# EAGLE design Master Volume 1.55 x 1.95 (EAGLE 6.5.0)
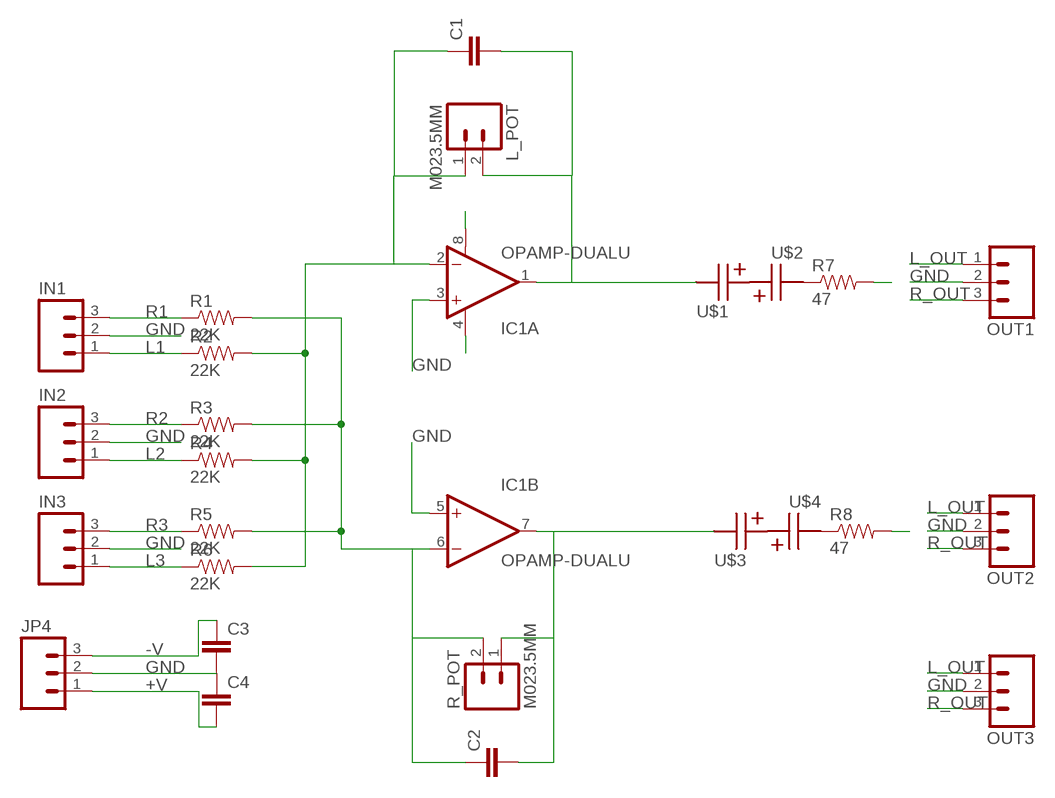
[diagram p0: schematic, sheet 1]

## Parts
C1  CAP0805  [0805]
C2  CAP0805  [0805]
C3  CAP1206  [1206]
C4  CAP1206  [1206]
IC1  OPAMP-DUALU  [SO08]
IN1  M03SCREW  [SCREWTERMINAL-3.5MM-3]
IN2  M03SCREW  [SCREWTERMINAL-3.5MM-3]
IN3  M03SCREW  [SCREWTERMINAL-3.5MM-3]
JP4  M03SCREW  [SCREWTERMINAL-3.5MM-3]
L_POT  M023.5MM  [SCREWTERMINAL-3.5MM-2]
OUT1  M03SCREW  [SCREWTERMINAL-3.5MM-3]
OUT2  M03SCREW  [SCREWTERMINAL-3.5MM-3]
OUT3  M03SCREW  [SCREWTERMINAL-3.5MM-3]
R1  22K  RESISTORPTH-1/4W  [AXIAL-0.4]
R2  22K  RESISTORPTH-1/4W  [AXIAL-0.4]
R3  22K  RESISTORPTH-1/4W  [AXIAL-0.4]
R4  22K  RESISTORPTH-1/4W  [AXIAL-0.4]
R5  22K  RESISTORPTH-1/4W  [AXIAL-0.4]
R6  22K  RESISTORPTH-1/4W  [AXIAL-0.4]
R7  47  RESISTORPTH-1/4W  [AXIAL-0.4]
R8  47  RESISTORPTH-1/4W  [AXIAL-0.4]
R_POT  M023.5MM  [SCREWTERMINAL-3.5MM-2]
U$1  5MM-12.5MM-POLAR2MMX5MM  [2MMLEAD_5MMDIAMETER]
U$2  5MM-12.5MM-POLAR2MMX5MM  [2MMLEAD_5MMDIAMETER]
U$3  5MM-12.5MM-POLAR2MMX5MM  [2MMLEAD_5MMDIAMETER]
U$4  5MM-12.5MM-POLAR2MMX5MM  [2MMLEAD_5MMDIAMETER]

## Nets
+V: C4.2 IC1.8(A:V+) JP4.1
-V: C3.1 IC1.4(A:V-) JP4.3
GND: C3.2 C4.1 IC1.3(A:+IN) IC1.5(B:+IN) IN1.2 IN2.2 IN3.2 JP4.2 OUT1.2 OUT2.2 OUT3.2
L1: IN1.1 R2.P$1
L2: IN2.1 R4.P$1
L3: IN3.1 R6.P$1
L_OUT: OUT1.1 OUT2.1 OUT3.1 R7.P$2
N$1: C1.1 IC1.2(A:-IN) L_POT.1 R2.P$2 R4.P$2 R6.P$2
N$2: C2.1 IC1.6(B:-IN) R1.P$2 R3.P$2 R5.P$2 R_POT.2
N$3: C1.2 IC1.1(A:OUT) L_POT.2 U$1.+(-)
N$4: C2.2 IC1.7(B:OUT) R_POT.1 U$3.+(-)
N$5: U$1.-(+) U$2.-(+)
N$6: U$3.-(+) U$4.-(+)
N$7: R7.P$1 U$2.+(-)
N$8: R8.P$1 U$4.+(-)
R1: IN1.3 R1.P$1
R2: IN2.3 R3.P$1
R3: IN3.3 R5.P$1
R_OUT: OUT1.3 OUT2.3 OUT3.3 R8.P$2

## Library data of the parts
C1-C4 = SparkFun-Capacitors:CAP: Capacitor Standard 0603 ceramic capacitor, and 0.1" leaded capacitor.
IC1 = SparkFun-AnalogIC:OPAMP-DUAL: Generic op-amp footprint
IN1-IN3 JP4 OUT1-OUT3 = SparkFun-Connectors:M03: Header 3 Standard 3-pin 0.1" header. Use with straight break away headers (SKU : PRT-00116), right angle break away headers (PRT-00553), swiss pins (PRT-00743), machine pins (PRT-00117), and female headers (PRT-00115). Molex polarized connector foot print use with SKU : PRT-08232 with associated crimp pins and housings.
L_POT R_POT = SparkFun-Connectors:M02: Standard 2-pin 0.1" header. Use with - straight break away headers ( PRT-00116) - right angle break away headers (PRT-00553) - swiss pins (PRT-00743) - machine pins (PRT-00117) - female headers (PRT-00115) Molex polarized connector foot print use with: PRT-08233 with associated crimp pins and housings. 2.54_SCREWTERM for use with PRT-10571. 3.5mm Screw Terminal footprints for PRT-08084 5mm Screw Terminal footprints for use with PRT-08433
R1-R8 = SparkFun-Resistors:RESISTOR: Resistor Basic schematic elements and footprints for 0603, 1206, and PTH resistors.
U$1-U$4 = AMP Library:5MM-12.5MM-POLAR

## Board
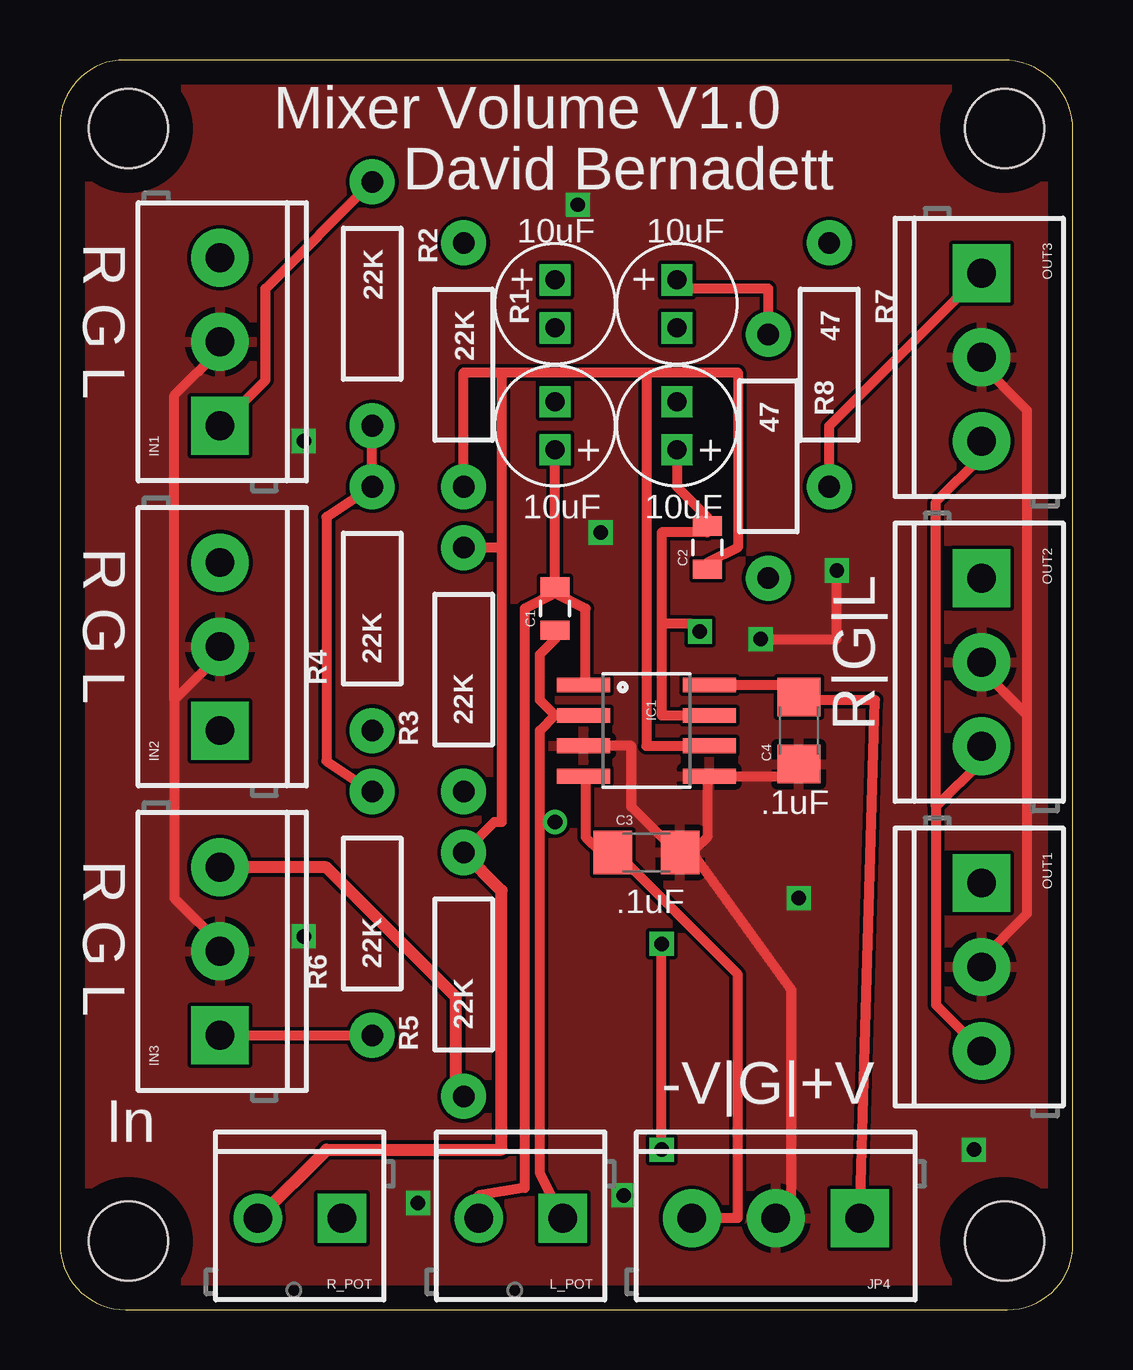
[diagram p1: board, top side]
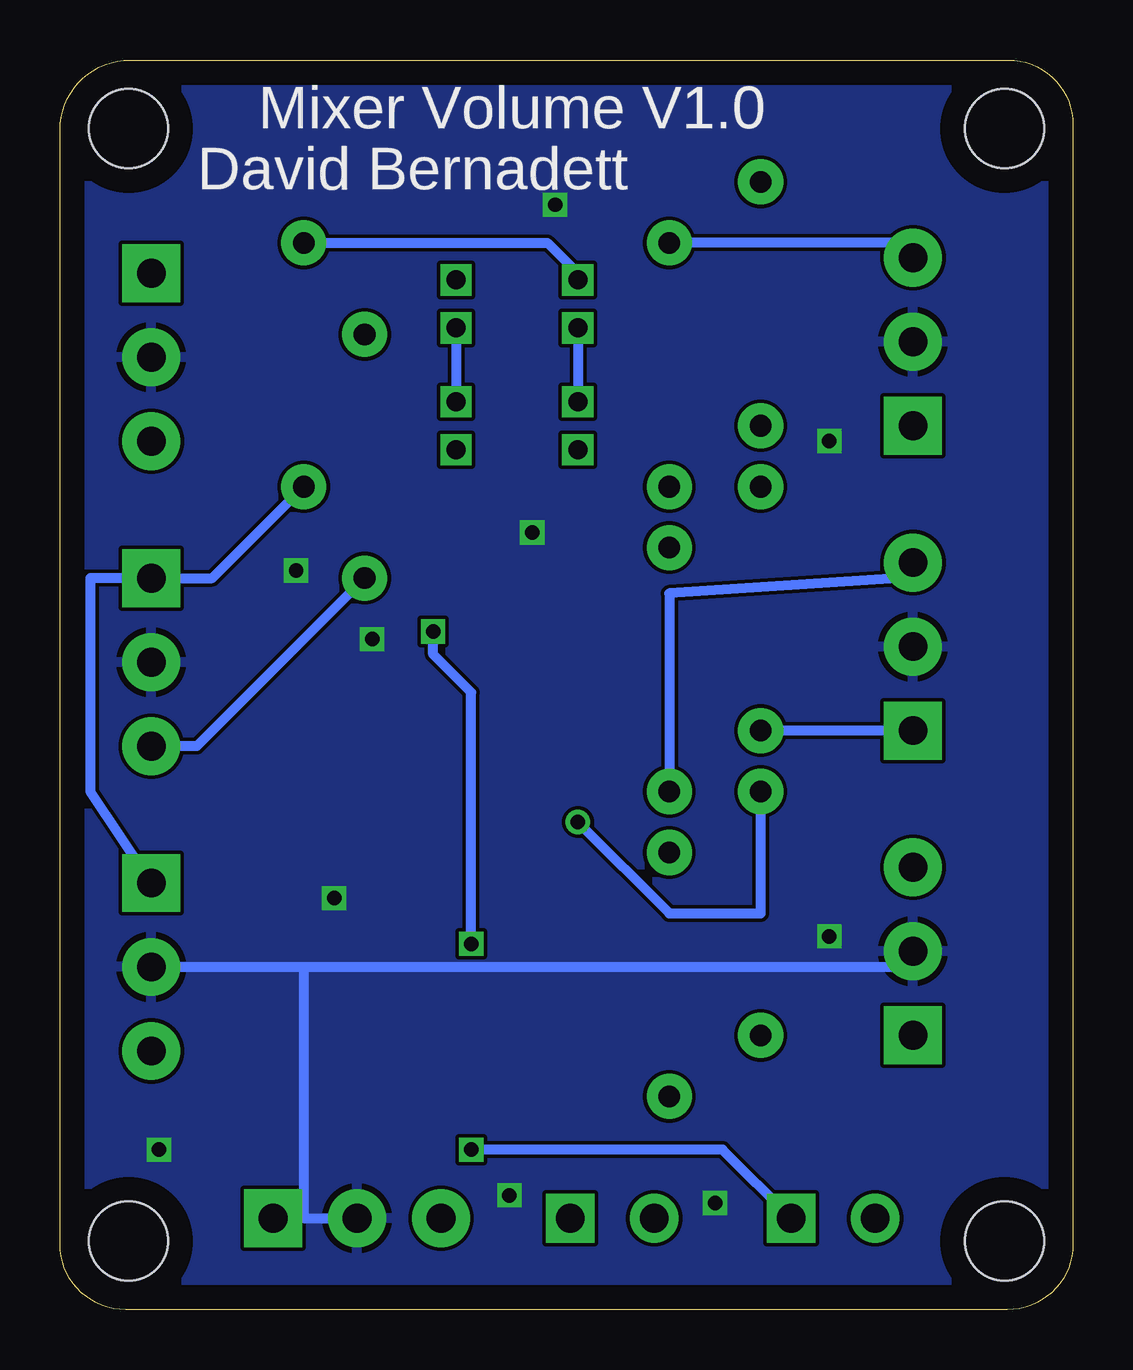
[diagram p2: board, bottom side, seen from below]

Size 42.23 x 52.07 mm. Coordinates in mm from the lower left corner, seen from the top.
Outline: 2.73,0 39.5,0 arc90 42.23,2.73 42.23,49.14 arc90 39.3,52.07 2.69,52.07 arc90 0,49.38 0,2.73 arc90 2.73,0
Copper layers (1*16): Top 0.035mm / dielectric 1.5mm / Bottom 0.035mm
Design rules "default *": minimum track width 10mil, minimum drill 24mil, track to track 6mil, track to pad 8mil, pad to pad 8mil, via to via 8mil, smd to smd 8mil, copper to edge 40mil, drill to drill 8mil, minimum pad ring 10mil, minimum via ring 8mil, stop-mask expansion 4mil, vias tented up to drill 0mil, thermal gap 10mil

### Footprints (pad centres in the part's own frame; a part is rotated, then mirrored left to right if it is on the bottom)
0805 = smd 0.8 x 1.2: 1 -0.9,0; 2 0.9,0
1206 = smd 1.6 x 1.8: 1 -1.4,0; 2 1.4,0
SO08 = smd 0.61 x 2.21: 1 -1.905,-2.616; 2 -0.635,-2.616; 3 0.635,-2.616; 4 1.905,-2.616; 5 1.905,2.616; 6 0.635,2.616; 7 -0.635,2.616; 8 -1.905,2.616
SCREWTERMINAL-3.5MM-3 = drill 1.2 pad 2.413 square: 1 0,0 | drill 1.2 pad 2.413: 2 3.5,0; 3 7,0
SCREWTERMINAL-3.5MM-2 = drill 1.2 pad 2.032 square: 1 0,0 | drill 1.2 pad 2.032: 2 3.5,0
AXIAL-0.4 = drill 0.9 pad 1.88: P$1 -5.08,0; P$2 5.08,0
2MMLEAD_5MMDIAMETER = drill 0.8 square: + 1,0; - -1,0
STAND-OFF = hole 3.302: 0,0

### Placement (x,y rotation side)
C1  20.64,29.21 90 top
C2  26.99,31.75 90 top
C3  24.45,19.05 0 top
C4  30.8,24.13 90 top
IC1  24.45,24.13 270 top
IN1  6.67,36.83 90 top
IN2  6.67,24.13 90 top
IN3  6.67,11.43 90 top
JP4  33.34,3.81 180 top
L_POT  20.95,3.81 180 top
OUT1  38.42,17.78 270 top
OUT2  38.42,30.48 270 top
OUT3  38.42,43.18 270 top
R1  16.83,39.37 270 top
R2  13.02,41.91 270 top
R3  16.83,26.67 90 top
R4  13.02,29.21 90 top
R5  16.83,13.97 90 top
R6  13.02,16.51 90 top
R7  32.07,39.37 270 top
R8  29.53,35.56 270 top
R_POT  11.75,3.81 180 top
U$1  20.64,36.83 270 top
U$2  20.64,41.91 90 top
U$3  25.72,36.83 270 top
U$4  25.72,41.91 90 top
U$5  [STAND-OFF]  2.86,2.86 0 top
U$6  [STAND-OFF]  39.37,2.86 0 top
U$7  [STAND-OFF]  2.86,49.21 0 top
U$8  [STAND-OFF]  39.37,49.21 0 top

### Tracks (layer width: path | path; a pad name or v marks a point on that pad's centre or on a via)
+V
  Top 0.406: IC1.8 30.8,26.04 C4.2 30.8,25.4 33.97,25.4 JP4.1
-V
  Top 0.406: IC1.4 21.91,22.23 21.91,19.68 22.54,19.05 C3.1 23.18,19.05 28.26,13.97 28.26,3.81 JP4.3
GND  (via drill 0.6)
  Top 0.406: 4.76,25.4 4.76,17.14 6.67,15.24 IN3.2 | 4.76,25.4 6.67,27.3 IN2.2 | 4.76,25.4 4.76,38.1 6.67,40.01 IN1.2 | 26.35,19.05 26.99,19.68 26.99,22.23 IC1.5 30.8,22.23 C4.1 | IC1.3 23.81,23.5 23.81,20.95 25.72,19.05 C3.2 26.35,19.05 | 40.32,24.77 38.42,26.67 OUT2.2 | 40.32,24.77 40.32,16.51 38.42,14.61 OUT1.2 | 40.32,24.77 40.32,37.47 38.42,39.37 OUT3.2 | 26.35,19.05 30.48,13.34 30.48,3.81 JP4.2 | v29.21,27.94 32.38,27.94 v32.38,30.8
  Bottom 0.406: 32.07,14.29 32.07,3.81 JP4.2 | 32.07,14.29 OUT1.2 | 32.07,14.29 7.3,14.29 6.67,14.61 IN3.2
  other vias: 30.8,17.14 22.54,32.38 21.59,46.04 38.1,6.67 10.16,36.2 10.16,15.56 14.92,4.45 23.49,4.76
  pour Bottom: 0,52.07 42.23,52.07 42.23,0 0,0
  pour Top: 0,52.07 0,0 42.23,0 42.23,52.07
L1
  Top 0.406: R2.P$1 8.57,42.55 8.57,38.73 IN1.1
L2
  Bottom 0.406: IN2.1 R4.P$1
L3
  Top 0.406: IN3.1 R6.P$1
L_OUT
  Top 0.406: OUT3.1 32.07,36.83 R7.P$2
  Bottom 0.406: R7.P$2 35.88,30.48 OUT2.1 40.96,30.48 40.96,21.59 OUT1.1
N$1  (via drill 0.61)
  Top 0.406: R6.P$2 11.11,22.86 11.11,33.02 R4.P$2 R2.P$2 | 20.64,24.77 20,25.4 20,27.3 20.64,27.94 C1.1 | IC1.2 20.64,24.77 | 20.64,24.77 20,24.13 20,20.32 | 20,20.32 20,5.71 L_POT.1 | 20,20.32 v20.64,20.32
  Bottom 0.406: R6.P$2 13.02,16.51 16.83,16.51 v20.64,20.32
N$2
  Top 0.406: 18.41,39.05 16.83,39.05 R1.P$2 | 18.41,39.05 24.45,39.05 | 24.45,39.05 28.26,39.05 28.26,31.75 26.99,31.11 C2.1 | IC1.6 24.45,23.5 24.45,39.05 | R5.P$2 18.1,20.32 18.41,20.32 18.41,31.75 | 18.41,39.05 18.41,31.75 | 18.41,31.75 R3.P$2
  Top 0.508: R_POT.2 11.11,6.67 18.41,6.67 18.41,17.46 R5.P$2
N$3
  Top 0.406: 20.64,29.84 21.91,29.21 21.91,26.04 IC1.1 | U$1.+ C1.2 20.64,29.84 | 20.64,29.84 19.37,29.21 19.37,5.08 17.46,4.76 L_POT.2
N$4  (via drill 0.6)
  Top 0.406: U$3.+ 25.72,34.29 26.99,33.02 C2.2 26.99,32.38 25.08,32.38 25.08,28.57 | IC1.7 25.08,24.77 25.08,28.57 | v25.08,6.67 v25.08,15.24 | v26.67,28.26 26.35,28.57 25.08,28.57
  Bottom 0.406: R_POT.1 14.61,6.67 v25.08,6.67 | v25.08,15.24 25.08,25.72 26.67,27.3 v26.67,28.26
N$5
  Bottom 0.406: U$2.- U$1.-
N$6
  Bottom 0.406: U$4.- U$3.-
N$7
  Bottom 0.406: R7.P$1 21.91,44.45 20.64,43.18 U$2.+
N$8
  Top 0.406: R8.P$1 29.53,42.55 25.72,42.55 U$4.+
R1
  Bottom 0.406: R1.P$1 6.67,44.45 IN1.3
R2
  Bottom 0.406: R3.P$1 16.83,29.84 7.3,30.48 6.67,31.11 IN2.3
R3
  Top 0.508: R5.P$1 16.51,9.21 16.51,13.02 11.1,18.43 IN3.3
R_OUT
  Top 0.406: 36.51,20.95 36.51,12.7 38.42,10.79 OUT1.3 | 36.51,20.95 38.42,22.86 OUT2.3 | 36.51,20.95 36.51,33.66 38.42,35.56 OUT3.3
  Bottom 0.406: R8.P$2 36.51,23.5 38.42,23.5 OUT2.3

### Text on the board
tPlace: Mixer Volume V1.0 | David Bernadett | R G L | R G L | R|G|L | R G L | -V|G|+V | In
bPlace: Mixer Volume V1.0 | David Bernadett
tNames: 10uF | 10uF | 10uF | 10uF | .1uF | .1uF